# Altium project Bluetooth_Speaker.PrjPcb
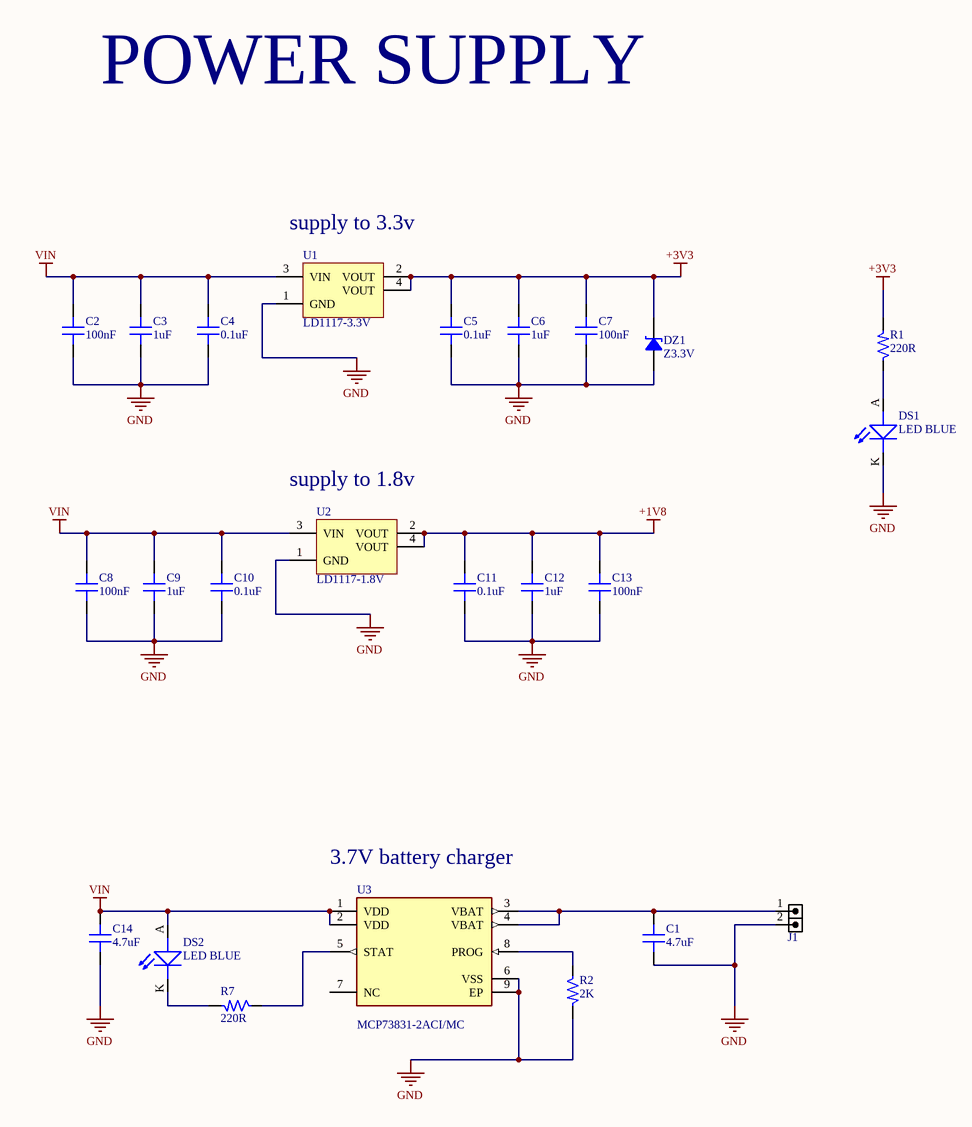
[diagram p0: [1]-power sypply.SchDoc]
3 sheets, 77 parts. Net scope: global (net labels, ports and power ports of the same name join across sheets).
Board file: Bluetooth_Speaker.PcbDoc
Sheets:
  [1]-power sypply.SchDoc
  [2]- MCU .SchDoc
  [3]-DAC.SchDoc

## Sheet [1]-power sypply.SchDoc
size A3; SheetNumber: 1; SheetTotal: 3

### Parts
C1  4.7uF  [CAP 0603_1608]
C2  100nF  [CAP 0603_1608]
C3  1uF  [CAP 0603_1608]
C4  0.1uF  [CAP 0603_1608]
C5  0.1uF  [CAP 0603_1608]
C6  1uF  [CAP 0603_1608]
C7  100nF  [CAP 0603_1608]
C8  100nF  [CAP 0603_1608]
C9  1uF  [CAP 0603_1608]
C10  0.1uF  [CAP 0603_1608]
C11  0.1uF  [CAP 0603_1608]
C12  1uF  [CAP 0603_1608]
C13  100nF  [CAP 0603_1608]
C14  4.7uF  [CAP 0603_1608]
DS1  LED BLUE  [LED_0805]
DS2  LED BLUE  [LED_0805]
DZ1  Z3.3V  [SOD-323]
J1  HDR2  [HDR1SE_M_1X2]  (value not drawn)
R1  220R  [RES_0805]
R2  2K  [RES_0805]
R7  220R  [RES_0805]
U1  LD1117-3.3V  [SOT-223-4 6.5X7MM P2.3MM]
U2  LD1117-1.8V  [SOT-223-4 6.5X7MM P2.3MM]
U3  MCP73831-2ACI/MC  [FP-C04-123-MFG]

### Nets
+1V8: C11.2 C12.2 C13.2 U2.2(VOUT) U2.4(VOUT)
+3V3: C5.2 C6.2 C7.2 DZ1.2 R1.2 U1.2(VOUT) U1.4(VOUT)
GND: C1.1 C2.1 C3.1 C4.1 C5.1 C6.1 C7.1 C8.1 C9.1 C10.1 C11.1 C12.1 C13.1 C14.1 DS1.K(CATHODE) DZ1.1 J1.2 R2.2 U1.1(GND) U2.1(GND) U3.6(VSS) U3.9(EP)
VIN: C2.2 C3.2 C4.2 C8.2 C9.2 C10.2 C14.2 DS2.A(ANODE) U1.3(VIN) U2.3(VIN) U3.1(VDD) U3.2(VDD)
NetC1_2: C1.2 J1.1 U3.3(VBAT) U3.4(VBAT)
NetDS1_A: DS1.A(ANODE) R1.1
NetDS2_K: DS2.K(CATHODE) R7.2
NetR2_1: R2.1 U3.8(PROG)
NetR7_1: R7.1 U3.5(STAT)

Not connected (* = marked no-connect by the designer): U3 7(NC)

### Notes on the sheet
- POWER SUPPLY
- (near U1) supply to 3.3v
- (near U2) supply to 1.8v
- (near U3) 3.7V battery charger

### Library data of the parts
C1 C3-C6 C9-C12 C14 = Cap 0603: SMT Capacitor; VALUE: 100nF
C2 C7 C8 C13 = Cap 0603: SMT Capacitor; VALUE: 100nF
DS1 DS2 = LED_BLUE-3V3-20mA-0805: Blue 470nm LED Indication - Discrete 3.3V 0805 (2012 Metric); Manufacturer: Vishay Lite-On; Manufacturer Part Number: LTST-C171TBKT; Alternate Part Number-1: NA; Case/Package: 0805; Supplier-1: SP ROAD; Supplier Part Number-1: LTST-C171TBKT
DZ1 = Zener 200mW 3.3V (SMD SOD-323): Zener Diode; PartNumber: BZX384B3V3-G
J1 = HDRTST_1X2: HEADER, 1mm pitch, test, SMD; VALUE: HDR2
R1 R2 R7 = RES_220R-0.125W-1%-0805: 220 Ohms ±1% 0.125W, 1/8W Chip Resistor 0805 (2012 Metric) Automotive AEC-Q200 Thick Film; Manufacturer: Walsin; Manufacturer Part Number: WR08X2200FTL; Alternate Part Number-1: RS-05K2200FT; Case/Package: 0805; Supplier-1: SIRICOM; Supplier Part Number-1: WR08X2200FTL
U1 = LD1117-3.3V (SMD SOT-223): Linear Voltage Regulator IC  1 Output  800mA SOT-223; PartNumber: LD1117S33CTR
U2 = LD1117-1.8V (SMD SOT-223): Linear Voltage Regulator IC  1 Output  800mA SOT-223; PartNumber: LD1117S18CTR
U3 = CMP-06318-000002-1: IC CONTROLLER LI-ION 4.2V 8DFN; Manufacturer: Microchip; Number Of Cells: 1; Min Supply Voltage: 3.75V; Standoff Height: 0mm; Nominal Supply Current: 0.1-510uA; Max Junction Temp: +125°C; Max Supply Voltage: 6V; Temperature Range High: +85°C; Mouser Description: Battery Management Li-Ion/Li-Poly Charg Mgnt 4.2V Vreg out; Device Class L2: Power Management ICs; ComponentLink2Description: Datasheet; Footprint Url: http://ww1.microchip.com/downloads/en/DeviceDoc/8L_DFN_2x3x0_9_MC_C04-123C.pdf; Output Voltage: 4.2V; ComponentLink2URL: http://ww1.microchip.com/downloads/en/DeviceDoc/20001984g.pdf; Package: C04-123; Ipc Land Pattern Name: DFN200X300X90-8; Number Of Outputs: 1; Manufacturer Part Number: MCP73831-2ACI/MC; Device Class L3: Battery Management; Device Class L1: Integrated Circuits (ICs); Digikey Description: IC CONTROLLER LI-ION 4.2V 8DFN; Category: IC; Temperature Range Low: -40°C; Automotive: No; Temperature: -40°C to +85°C; Octopart: https://octopart.com/mcp73831-2aci%2Fmc-microchip-16517355; RoHS: TRUE; Ambient Temperature Range Low: -40°C; Height: 1mm; Lead Free: Yes; Ambient Temperature Range High: +85°C

## Sheet [2]- MCU .SchDoc
size A3; SheetNumber: 2; SheetTotal: 3
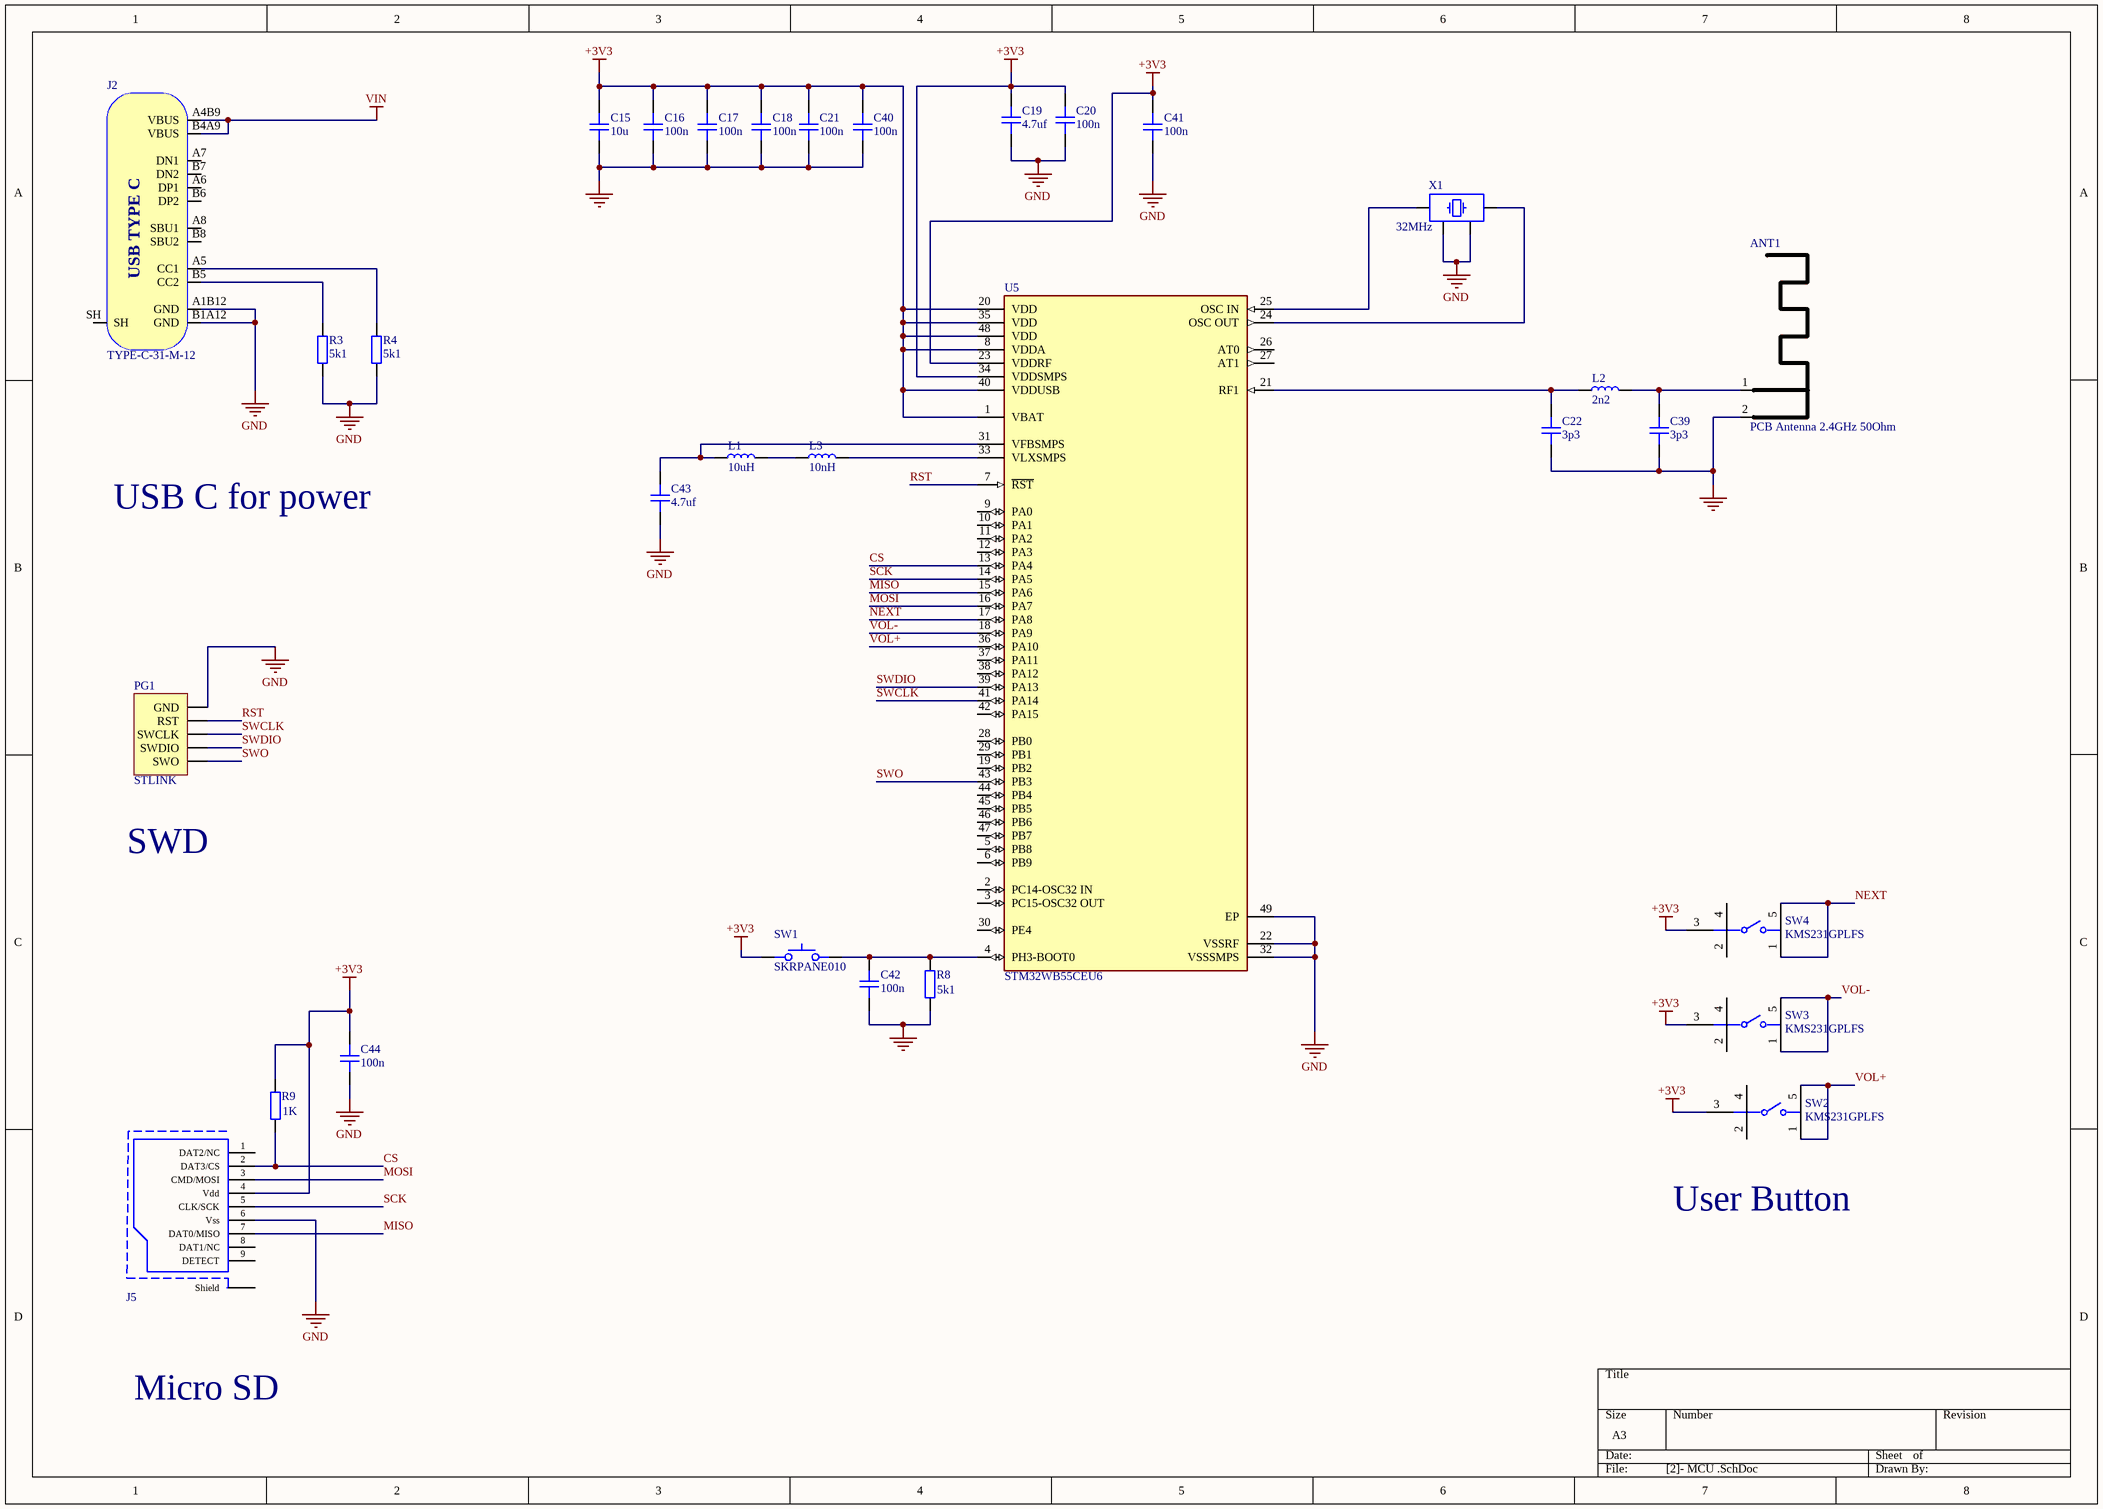
[diagram p1: [2]- MCU .SchDoc]

### Parts
ANT1  PCB Antenna 2.4GHz 50Ohm  [ANT_IFA_USB_2_4GHZ_50R]  (no BOM)
C15  10u  [CAP_0603]
C16  100n  [CAP_0402]
C17  100n  [CAP_0402]
C18  100n  [CAP_0402]
C19  4.7uf  [CAP_0402]
C20  100n  [CAP_0402]
C21  100n  [CAP_0402]
C22  3p3  [CAP_0402]
C39  3p3  [CAP_0402]
C40  100n  [CAP_0402]
C41  100n  [CAP_0402]
C42  100n  [CAP_0402]
C43  4.7uf  [CAP_0603]
C44  100n  [CAP_0402]
J2  TYPE-C-31-M-12  [TYPE-C-31-M-12]
J5  Micro SD  [TFP-09-2-12B]  (value not drawn)
L1  10uH  [IND_0402]
L2  2n2  [IND_0402]
L3  10nH  [IND_0402]
PG1  STLINK  [HDR_M_1X5]
R3  5k1  [RES_0402]
R4  5k1  [RES_0402]
R8  5k1  [RES_0402]
R9  1K  [RES_0402]
SW1  SKRPANE010  [SKRPANE010]
SW2  KMS231GPLFS  [FP-KMS231GPLFS-MFG]
SW3  KMS231GPLFS  [FP-KMS231GPLFS-MFG]
SW4  KMS231GPLFS  [FP-KMS231GPLFS-MFG]
U5  STM32WB55CEU6  [FP-UFQFPN48-A0B9-MFG]
X1  32MHz  [XTAL_2520]

### Nets
+3V3: C15.2 C16.2 C17.2 C18.2 C19.2 C20.2 C21.2 C40.2 C41.2 C44.2 J5.4(Vdd) R9.2 SW1.34 SW2.3 SW3.3 SW4.3 U5.1(VBAT) U5.8(VDDA) U5.20(VDD) U5.23(VDDRF) U5.34(VDDSMPS) U5.35(VDD) U5.40(VDDUSB) U5.48(VDD)
GND: ANT1.2(GND) C15.1 C16.1 C17.1 C18.1 C19.1 C20.1 C21.1 C22.1 C39.1 C40.1 C41.1 C42.1 C43.1 C44.1 J2.A1B12(GND) J2.B1A12(GND) J5.6(Vss) PG1.1(GND) R3.1 R4.1 R8.1 U5.22(VSSRF) U5.32(VSSSMPS) U5.49(EP) X1.2 X1.4
VIN: J2.A4B9(VBUS) J2.B4A9(VBUS)
CS: J5.2(DAT3/CS) R9.1 U5.13(PA4)
MISO: J5.7(DAT0/MISO) U5.15(PA6)
MOSI: J5.3(CMD/MOSI) U5.16(PA7)
NEXT: SW4.1 SW4.5 U5.17(PA8)
RST: PG1.2(RST) U5.7(~{RST})
SCK: J5.5(CLK/SCK) U5.14(PA5)
SWCLK: PG1.3(SWCLK) U5.41(PA14)
SWDIO: PG1.4(SWDIO) U5.39(PA13)
SWO: PG1.5(SWO) U5.43(PB3)
VOL+: SW2.1 SW2.5 U5.36(PA10)
VOL-: SW3.1 SW3.5 U5.18(PA9)
NetANT1_1: ANT1.1(RF) C39.2 L2.1
NetC22_2: C22.2 L2.2 U5.21(RF1)
NetC42_2: C42.2 R8.2 SW1.12 U5.4(PH3-BOOT0)
NetC43_2: C43.2 L1.2 U5.31(VFBSMPS)
NetJ2_A5: J2.A5(CC1) R4.2
NetJ2_B5: J2.B5(CC2) R3.2
NetL1_1: L1.1 L3.2
NetL3_1: L3.1 U5.33(VLXSMPS)
NetU5_24: U5.24(OSC_OUT) X1.3
NetU5_25: U5.25(OSC_IN) X1.1

Not connected (* = marked no-connect by the designer): J2 A6(DP1) A7(DN1) A8(SBU1) B6(DP2) B7(DN2) B8(SBU2) SH; J5 1(DAT2/NC) 8(DAT1/NC) 9(DETECT) 10(Shield); SW2 2 4; SW3 2 4; SW4 2 4; U5 2(PC14-OSC32_IN) 3(PC15-OSC32_OUT) 5(PB8) 6(PB9) 9(PA0) 10(PA1) 11(PA2) 12(PA3) 19(PB2) 26(AT0) 27(AT1) 28(PB0) 29(PB1) 30(PE4) 37(PA11) 38(PA12) 42(PA15) 44(PB4) 45(PB5) 46(PB6) 47(PB7)

### Notes on the sheet
- USB C for power
- SWD
- User Button
- Micro SD
- (in symbol TYPE-C-31-M-12) USB TYPE C

### Library data of the parts
ANT1 = ANT_IFA_USB_2_4GHZ_50R: Inverted F 2.4GHz ISM PCB Antenna 50 Ohm; ComponentLink1Description: Datasheet; ComponentLink1URL: https://www.ti.com/lit/an/swra117d/swra117d.pdf
C15 C43 = CAP_0603_10V: Capacitor SMD 0603 10V; Manufacturer: Samsung; Manufacturer Part Number: CL10A106KP8NNNC; LCSC: C19702
C16-C18 C20 C21 C40-C42 C44 = CAP_0402_50V: Capacitor SMD 0402 50V; Manufacturer: Samsung; Manufacturer Part Number: CL05B104KO5NNNC; LCSC: C1525
C19 C22 C39 = CAP_0402_50V: Capacitor SMD 0402 50V; Manufacturer: FH; Manufacturer Part Number: 0402CG3R3C500NT; LCSC: C1565
J2 = TYPE-C-31-M-12: USB Type C Connector Horizontal SMT; Manufacturer: Koren Hroparts; Manufacturer Part Number: TYPE-C-31-M-12; LCSC: C165948
J5 = Micro SD TFP-09-2-12B: PartNumber: TFP-09-2-12B
L1-L3 = IND_0402: Inductor SMD 0402; Manufacturer: Murata; Manufacturer Part Number: LQW15AN2N2G80D; LCSC: C412264
PG1 = STLINK Header P2.54mm (THD): PartNumber: Header 1X5 P2.54mm
R3 R4 R8 R9 = RES_0402: Resistor SMD 0402; Manufacturer: YAGEO; Manufacturer Part Number: RC0402JR-075K1L; LCSC: C105873
SW1 = SKRPANE010: Tactile Switch SMD SPST; Manufacturer: Alps Alpine; Manufacturer Part Number: SKRPANE010; LCSC: C470426
SW2-SW4 = CMP-10040-000026-1: SWITCH TACTILE SPST-NO 0.05A 50V; Contact Current Rating: 50mA; Max Voltage Rating (DC): 32V; Switch Travel: 0.3mm; Illumination Type: Illuminated; Power Rating: 1W; Operating Force: 3N; Switch Function: Off-Mom; Ratings: IP40; Actuator Length: 0.75mm; Mechanical Life: 100000Cycles; Throw Configuration: SPST; Min Operating Temperature: -40°C; Orientation: Right Angle; Radiation Hardening: No; Mount: Surface Mount; Max Current Rating: 50mA; Packaging: Tape and Reel; Width: 1.42mm; Depth: 4.6mm; Termination: Gull Wing; Contact Plating: Silver; Lead Free: Lead Free; Max Operating Temperature: 85°C; Length: 3.55mm; Current Rating: 50mA; Voltage Rating (DC): 32V; Package Quantity: 1; Contact Material: Silver
U5 = CMP-12160-000002-1: ULTRA-LOW-POWER DUAL CORE ARM CO; Manufacturer: STMicroelectronics; Max Junction Temp: +125°C; Data Rate: 2Mbits/s; Number Of Gpio: 30; Max Supply Voltage: 3.6V; Min Supply Voltage: 1.71V; Number Of Adc Channels: 13; Standoff Height: 0mm; Bandwidth: 2402-2480MHz; Max Frequency: 2480MHz; Interface: I2C,SPI,UART,USART,USB,Other; Max Power Dissipation: 392mW; Sensitivity: -100dBm; Temperature Range Low: -40°C; Digikey Description: ULTRA-LOW-POWER DUAL CORE ARM CO; Package: UFQFPN48-A0B9; ComponentLink2URL: https://www.st.com/resource/en/datasheet/stm32wb55rg.pdf; Ambient Temperature Range Low: -40°C; Automotive: No; Lead Free: Yes; RoHS: TRUE; Height: 0.65mm; Device Class L1: Integrated Circuits (ICs); Octopart: https://octopart.com/stm32wb55ceu6-stmicroelectronics-96611730; Device Class L2: RF Semiconductors and Devices; Ambient Temperature Range High: +105°C; Ipc Land Pattern Name: QFN50P700X700X57-48; Device Class L3: Transceivers; Category: IC; Temperature: -40°C to +125°C; ComponentLink2Description: Datasheet; Manufacturer Part Number: STM32WB55CEU6; Temperature Range High: +125°C
X1 = XTAL_2520: Crystal SMD 2520; Manufacturer: Seiko Epson; Manufacturer Number: Q24FA20H0020900; Frequency: 40MHz; LCSC: C255973

## Sheet [3]-DAC.SchDoc
size A3; SheetNumber: 3; SheetTotal: 3
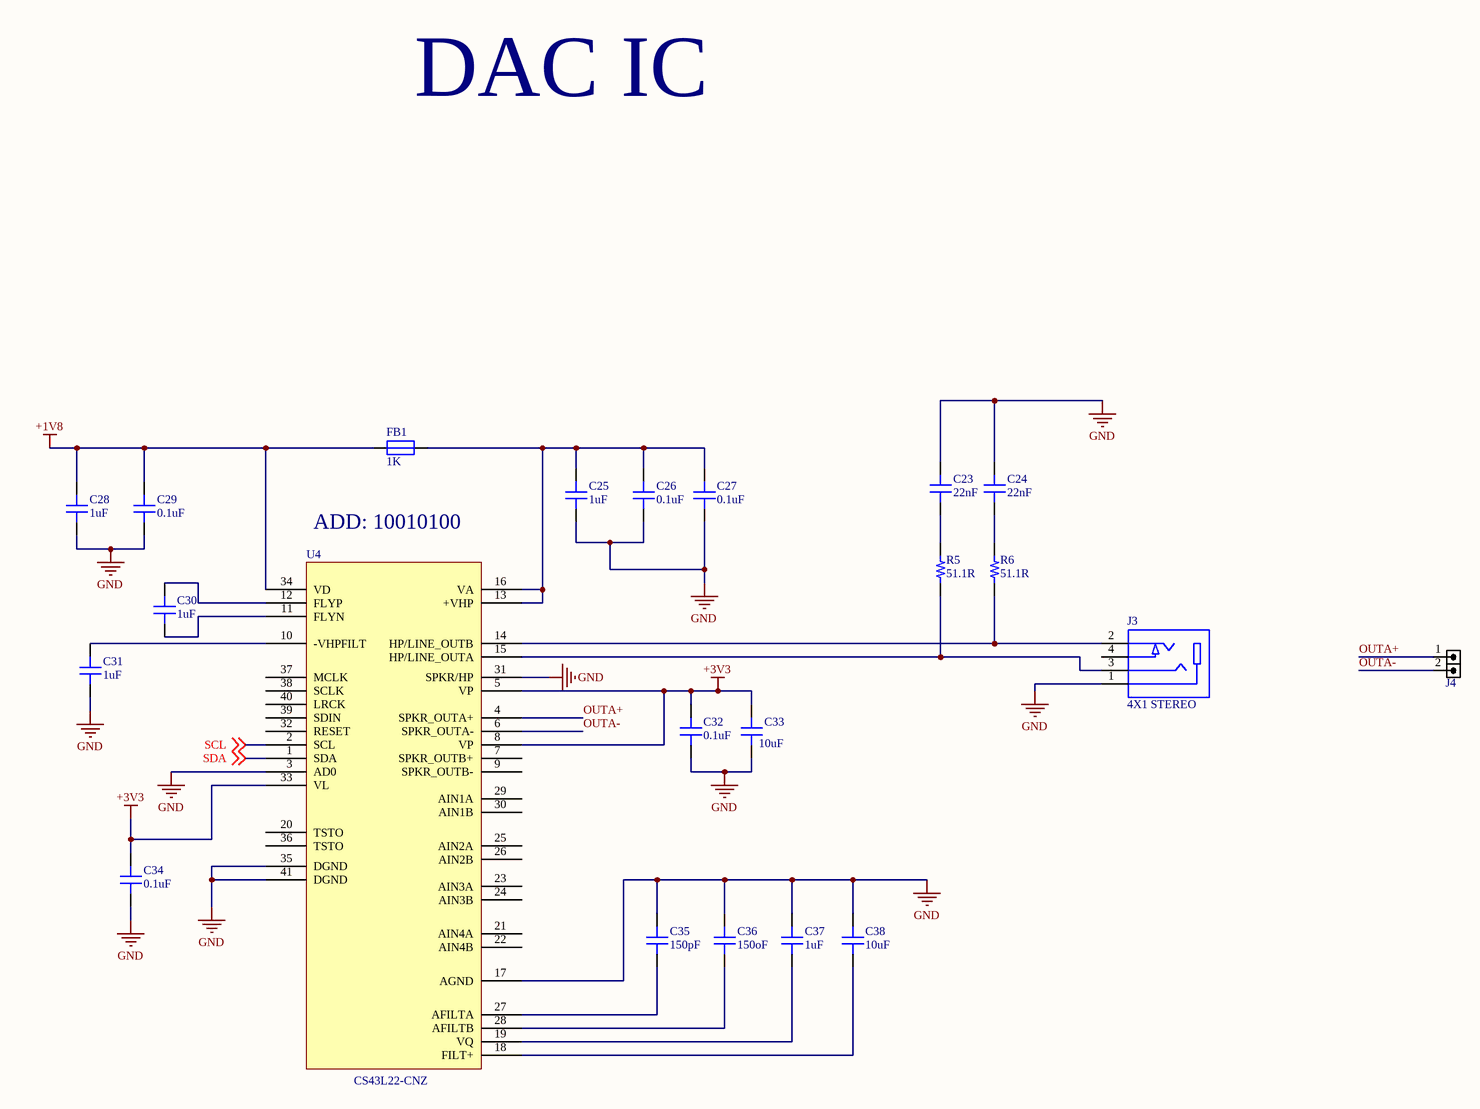
[diagram p2: [3]-DAC.SchDoc]

### Parts
C23  22nF  [CAP 0603_1608]
C24  22nF  [CAP 0603_1608]
C25  1uF  [CAP 0603_1608]
C26  0.1uF  [CAP 0603_1608]
C27  0.1uF  [CAP 0603_1608]
C28  1uF  [CAP 0603_1608]
C29  0.1uF  [CAP 0603_1608]
C30  1uF  [CAP 0603_1608]
C31  1uF  [CAP 0603_1608]
C32  0.1uF  [CAP 0603_1608]
C33  10uF  [CAP 0603_1608]
C34  0.1uF  [CAP 0603_1608]
C35  150pF  [CAP 0603_1608]
C36  150oF  [CAP 0603_1608]
C37  1uF  [CAP 0603_1608]
C38  10uF  [CAP 0603_1608]
FB1  1K  [IND_0805]
J3  4X1 STEREO  [CON_SJ-2504A-SMT-TR_SMD]
J4  HDR2  [HDR1SE_M_1X2]  (value not drawn)
R5  51.1R  [RES 0603_1608]
R6  51.1R  [RES 0603_1608]
U4  CS43L22-CNZ  [QFN40_19_284_33X9_SMD]

### Nets
+1V8: C28.2 C29.2 FB1.1 U4.34(VD)
+3V3: C32.2 C33.2 C34.2 U4.5(VP) U4.8(VP) U4.33(VL)
GND: C23.2 C24.2 C25.1 C26.1 C27.1 C28.1 C29.1 C31.1 C32.1 C33.1 C34.1 C35.2 C36.2 C37.2 C38.2 J3.1 U4.3(AD0) U4.17(AGND) U4.31(SPKR/HP) U4.35(DGND) U4.41(DGND)
OUTA+: J4.1 U4.4(SPKR_OUTA+)
OUTA-: J4.2 U4.6(SPKR_OUTA-)
SCL: U4.2(SCL) ; off-sheet SCL
SDA: U4.1(SDA) ; off-sheet SDA
NetC23_1: C23.1 R5.2
NetC24_1: C24.1 R6.2
NetC25_2: C25.2 C26.2 C27.2 FB1.2 U4.13(+VHP) U4.16(VA)
NetC30_1: C30.1 U4.12(FLYP)
NetC30_2: C30.2 U4.11(FLYN)
NetC31_2: C31.2 U4.10(-VHPFILT)
NetC35_1: C35.1 U4.27(AFILTA)
NetC36_1: C36.1 U4.28(AFILTB)
NetC37_1: C37.1 U4.19(VQ)
NetC38_1: C38.1 U4.18(FILT+)
NetJ3_2: J3.2 R6.1 U4.14(HP/LINE_OUTB)
NetJ3_3: J3.3 R5.1 U4.15(HP/LINE_OUTA)

Not connected (* = marked no-connect by the designer): J3 4; U4 7(SPKR_OUTB+) 9(SPKR_OUTB-) 20(TSTO) 21(AIN4A) 22(AIN4B) 23(AIN3A) 24(AIN3B) 25(AIN2A) 26(AIN2B) 29(AIN1A) 30(AIN1B) 32(RESET) 36(TSTO) 37(MCLK) 38(SCLK) 39(SDIN) 40(LRCK)

### Notes on the sheet
- DAC IC
- ADD: 10010100

### Library data of the parts
C23-C38 = Cap 0603: SMT Capacitor; VALUE: 100nF
FB1 = FB_1K-100MHZ-1.6A-0805: 1 kOhms @ 100MHz 1 Power Line Ferrite Bead 0805 (2012 Metric) 1.6A; Manufacturer: Laird; Manufacturer Part Number: BLM21SP102SH1D; Alternate Part Number-1: NA; Case/Package: 0805; Supplier-1: SIRICOM; Supplier Part Number-1: ACMS201209A102
J3 = CON-PLG-STEREO_4X1-100-RA-SMD: 2.50mm (0.094", 3/32", Sub Mini, Miniature) - Headphone Phone Jack Stereo (4 Conductor, TRRS) Connector Solder; Manufacturer: CUI Devices; Manufacturer Part Number: SJ-2504A-SMT-TR; Alternate Part Number-1: NA; Case/Package: SMD; Supplier Part Number-1: CP-SJ-2504A-SMT-CT-ND - Cut Tape (CT); Supplier-1: Digikey
J4 = HDRTST_1X2: HEADER, 1mm pitch, test, SMD; VALUE: HDR2
R5 R6 = Res 0603: SMT Resistor; VALUE: 1K
U4 = IC_CS43L22: Audio D/A Converter ICs Low Power Stereo DAC w/ClassD Spkr Driver; Manufacturer: Cirrus Logic; Alternate Part Number-1: NA; Manufacturer Part Number: CS43L22-CNZ; Case/Package: QFN-40; Supplier-1: Mouser; Supplier Part Number-1: 777-CS43L22-CNZ

## Nets that join several sheets
+1V8: [1]-power sypply (5 pins), [3]-DAC (C28.2 C29.2 FB1.1 U4.34)
+3V3: [1]-power sypply (7 pins), [2]- MCU  (24 pins), [3]-DAC (6 pins)
GND: [1]-power sypply (22 pins), [2]- MCU  (27 pins), [3]-DAC (21 pins)
VIN: [1]-power sypply (12 pins), [2]- MCU  (J2.A4B9 J2.B4A9)